# EAGLE design FM-VHF-Oscillator (EAGLE 7.2.0)
Simple FM Transmitter with Electret Microphone, based on NPN Transistor http://everycircuit.com/circuit/6675670832775168/radio---fm-vhf-oscillator-works-with--construction-hints
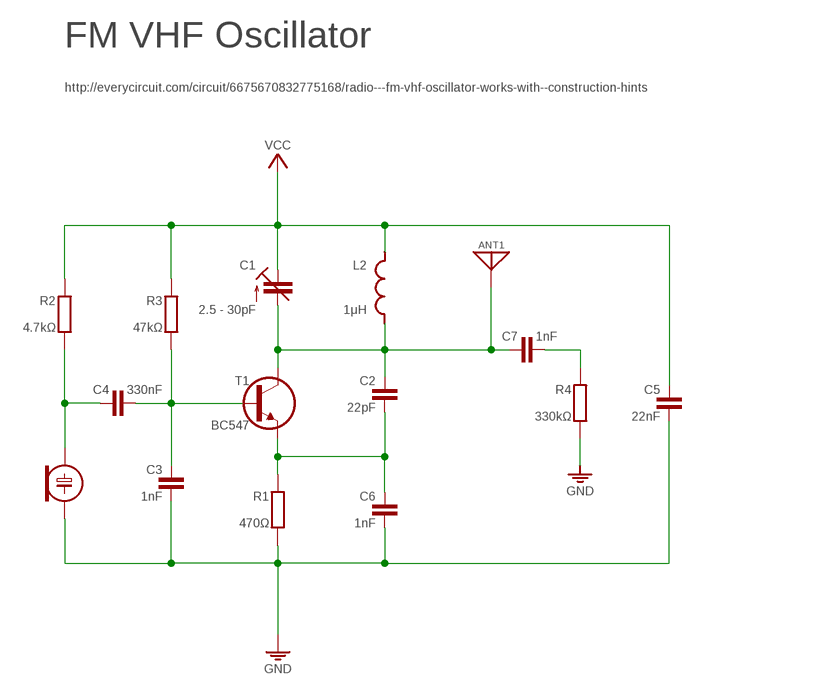
[diagram p0: schematic, sheet 1]

## Parts
ANT1  ANT  [SPAD]
C1  2.5 - 30pF  C-TR-PH201272222-808-2PINB  [TRIM-2222-808]
C2  22pF  C025-015X024  [C025-015X024]
C3  1nF  C050-020X036/V  [C050-020X036/V]
C4  330nF  C-H050-024X044  [C050-024X044]
C5  22nF  C050-020X044/V  [C050-020X044/V]
C6  1nF  C050-020X036  [C050-020X036]
C7  1nF  C-H050-024X044  [C050-024X044]
ECM  ECM-4  [ECM-4]
L2  1μH  L-SHORT04/7V-X  [L-04/7V-X]
R1  470Ω  R0204/2V  [0204/2V]
R2  4.7kΩ  R0202/7-V  [0202/7-V]
R3  47kΩ  R0202/7-V  [0202/7-V]
R4  330kΩ  R0202/5-V  [0202/5-V]
S2  VCC_GNDPWR-R  [PWR-R]
T1  BC547  BC547CBE  [TO92-CBE]

## Nets
GND: C3.2 C5.2 C6.2 ECM.2(-) R1.2 R4.2 S2.1
N$1: C7.2 R4.1
N$2: ANT1.1 C1.2(A) C2.1 C7.1 L2.1 T1.C
N$3: C2.2 C6.1 R1.1 T1.E
N$5: C3.1 C4.2 R3.2 T1.B
N$6: C4.1 ECM.1(+) R2.2
VCC: C1.3(E) C5.1 L2.2 R2.1 R3.1 S2.2

## Notes on the sheet
- FM VHF Oscillator
- http://everycircuit.com/circuit/6675670832775168/radio---fm-vhf-oscillator-works-with--construction-hints

## Library data of the parts
ANT1 = pad:ANT
C1 = cap-trim:C-TR-PH20127
C2 C3 C5 C6 = c:C: CAPACITOR, European symbol
C4 C7 = c:C-H
ECM = ECM:ECM
L2 = l:L-SHORT
R1-R4 = r:R: RESISTOR, European symbol
S2 = pad:VCC_GND
T1 = t:BC547

## Net classes
0 default: width 0.61 mm

## Board
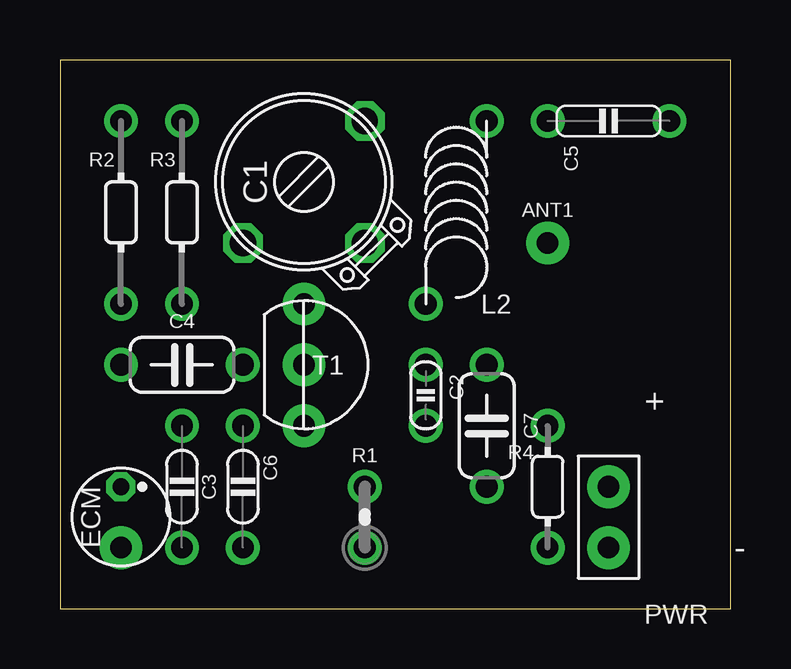
[diagram p1: board, top side]
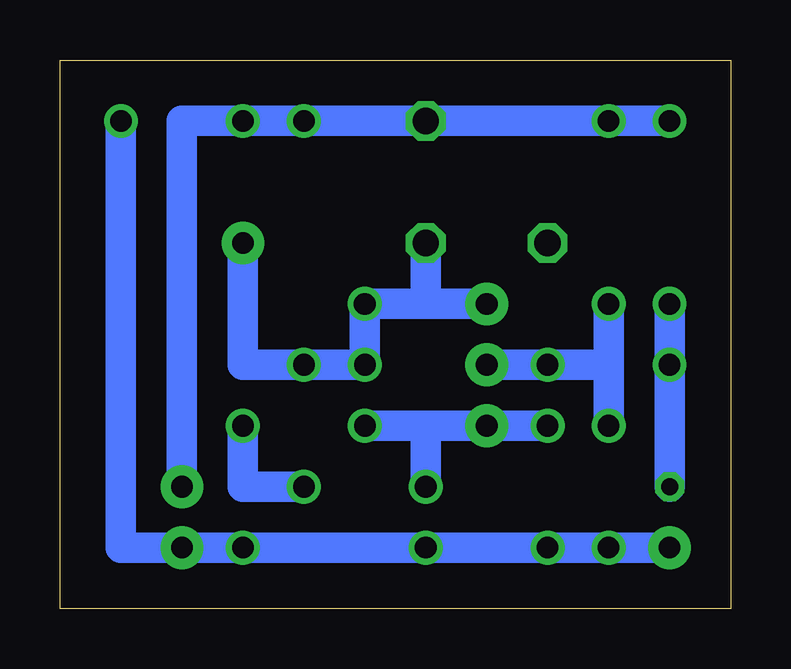
[diagram p2: board, bottom side, seen from below]

Size 27.94 x 22.86 mm. Coordinates in mm from the lower left corner, seen from the top.
Outline: 0,0 27.94,0 27.94,22.86 0,22.86 0,0
Copper layers (1*16): Top 0.035mm / dielectric 1.5mm / Bottom 0.035mm
Design rules "default": minimum track width 10mil, minimum drill 24mil, track to track 8mil, track to pad 8mil, pad to pad 8mil, via to via 8mil, smd to smd 8mil, copper to edge 40mil, drill to drill 8mil, minimum pad ring 10mil, minimum via ring 8mil, stop-mask expansion 4mil, vias tented up to drill 0mil, thermal gap 10mil

### Footprints (pad centres in the part's own frame; a part is rotated, then mirrored left to right if it is on the bottom)
SPAD = drill 0.9 pad 1.778: 1 0,0
TRIM-2222-808 = drill 1.1 octagon: 1 -2.54,2.54; 2 -2.54,-2.54; 3 2.54,-2.54
C025-015X024 = drill 0.9: 1 -1.27,0; 2 1.27,0
C050-020X036/V = drill 0.9: 1 0,-2.54; 2 0,2.54
C050-024X044 = drill 0.9: 1 -2.54,0; 2 2.54,0
C050-020X044/V = drill 0.9: 1 0,2.54; 2 0,-2.54
C050-020X036 = drill 0.9: 1 -2.54,0; 2 2.54,0
ECM-4 = drill 0.7 pad 1.2 octagon: 1 0,1.27 | drill 0.9 pad 1.778: 2 0,-1.27
L-04/7V-X = drill 0.9: 1 -1.27,-3.81; 2 1.27,3.81
0204/2V = drill 0.9: 1 0,1.27; 2 0,-1.27
0202/7-V = drill 0.9: 1 0,3.81; 2 0,-3.81
0202/5-V = drill 0.9: 1 0,2.54; 2 0,-2.54
PWR-R = drill 0.9 pad 1.778: 1 0,-1.27; 2 0,1.27
TO92-CBE = drill 0.9 pad 1.778: B 0,0; C 0,2.54; E 0,-2.54

### Placement (x,y rotation side)
ANT1  20.32,15.24 270 top
C1  10.16,17.78 90 top
C2  15.24,8.89 270 top
C3  5.08,5.08 180 top
C4  5.08,10.16 0 top
C5  22.86,20.32 90 top
C6  7.62,5.08 270 top
C7  17.78,7.62 270 top
ECM  2.54,3.81 0 top
L2  16.51,16.51 0 top
R1  12.7,3.81 0 top
R2  2.54,16.51 0 top
R3  5.08,16.51 0 top
R4  20.32,5.08 0 top
S2  22.86,3.81 0 top
T1  10.16,10.16 0 top

### Tracks (layer width: path | path; a pad name or v marks a point on that pad's centre or on a via)
GND
  Bottom 1.27: ECM.2 C3.2 R1.2 C6.2 R4.2 25.4,2.54 C5.2
N$1
  Bottom 1.27: C7.2 20.32,5.08 R4.1
N$2
  Bottom 1.27: C1.2 12.7,12.7 T1.C L2.1 C2.1 | C2.1 20.32,10.16 ANT1.1 | C7.1 C2.1
N$3
  Bottom 1.27: R1.1 12.7,7.62 C2.2 C6.1 T1.E
N$5
  Bottom 1.27: 5.08,10.16 R3.2 | 5.08,10.16 C4.2 T1.B | 5.08,10.16 C3.1
N$6
  Bottom 1.27: ECM.1 C4.1 R2.2
VCC
  Bottom 1.27: R2.1 R3.1 C1.3 L2.2 C5.1 22.86,20.32 S2.2